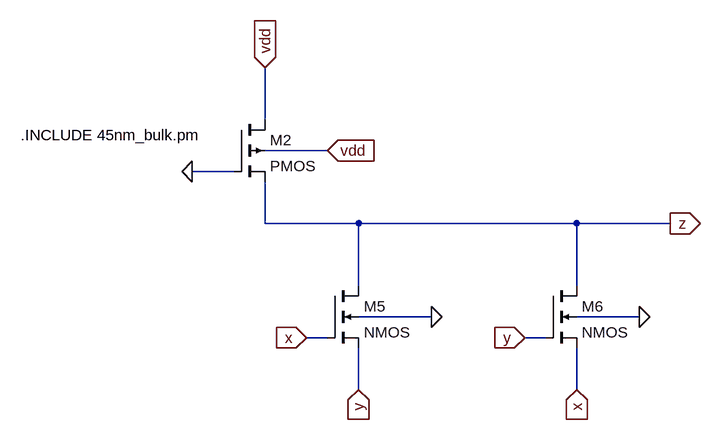
[diagram p0: schematic xnor_3T.asc]
xnor_3T.asc, the LTspice schematic file:
Version 4
SHEET 1 1432 820
WIRE 736 176 736 96
WIRE 832 224 736 224
WIRE 688 256 624 256
WIRE 736 336 736 272
WIRE 880 336 736 336
WIRE 1216 336 880 336
WIRE 1360 336 1216 336
WIRE 880 432 880 336
WIRE 1216 432 1216 336
WIRE 992 480 880 480
WIRE 1312 480 1216 480
WIRE 832 512 800 512
WIRE 1168 512 1136 512
WIRE 880 592 880 528
WIRE 1216 592 1216 528
FLAG 736 96 vdd
IOPIN 736 96 In
FLAG 832 224 vdd
IOPIN 832 224 In
FLAG 992 480 0
FLAG 1312 480 0
FLAG 800 512 x
IOPIN 800 512 In
FLAG 1216 592 x
IOPIN 1216 592 In
FLAG 880 592 y
IOPIN 880 592 In
FLAG 1136 512 y
IOPIN 1136 512 In
FLAG 1360 336 z
IOPIN 1360 336 Out
FLAG 624 256 0
SYMBOL pmos4 688 176 R0
SYMATTR InstName M2
SYMATTR Value2 l=45n w=45n
SYMBOL nmos4 832 432 R0
SYMATTR InstName M5
SYMATTR Value2 l=45n w=180n
SYMBOL nmos4 1168 432 R0
SYMATTR InstName M6
SYMATTR Value2 l=45n w=180n
TEXT 360 200 Left 2 !.INCLUDE 45nm_bulk.pm

The netlist it stands for:
* xnor_3T.asc
M2 vdd 0 z vdd PMOS l=45n w=45n
M5 z x y 0 NMOS l=45n w=180n
M6 z y x 0 NMOS l=45n w=180n
.model NMOS NMOS
.model PMOS PMOS
.lib standard.mos
.INCLUDE 45nm_bulk.pm
.backanno
.end